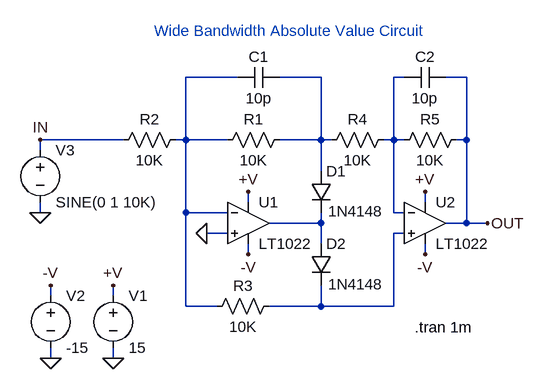
[diagram p0: schematic 1022.asc]
1022.asc, the LTspice schematic file:
Version 4
SHEET 1 896 680
WIRE 176 16 96 16
WIRE 304 16 240 16
WIRE 432 16 416 16
WIRE 528 16 496 16
WIRE 0 112 -128 112
WIRE 96 112 96 16
WIRE 96 112 80 112
WIRE 160 112 96 112
WIRE 304 112 304 16
WIRE 304 112 240 112
WIRE 320 112 304 112
WIRE 416 112 416 16
WIRE 416 112 400 112
WIRE 432 112 416 112
WIRE 528 112 528 16
WIRE 528 112 512 112
WIRE -128 128 -128 112
WIRE 304 160 304 112
WIRE 192 208 192 192
WIRE 464 208 464 192
WIRE -128 224 -128 208
WIRE 96 224 96 112
WIRE 160 224 96 224
WIRE 416 224 416 112
WIRE 432 224 416 224
WIRE 304 240 304 224
WIRE 304 240 224 240
WIRE 528 240 528 112
WIRE 528 240 496 240
WIRE 560 240 528 240
WIRE 160 256 128 256
WIRE 432 256 416 256
WIRE 304 272 304 240
WIRE 192 288 192 272
WIRE 464 288 464 272
WIRE -112 352 -112 336
WIRE -16 352 -16 336
WIRE 96 368 96 224
WIRE 144 368 96 368
WIRE 304 368 304 336
WIRE 304 368 224 368
WIRE 416 368 416 256
WIRE 416 368 304 368
WIRE -112 448 -112 432
WIRE -16 448 -16 432
FLAG -16 448 0
FLAG 192 192 +V
FLAG -16 336 +V
FLAG 192 288 -V
FLAG -112 448 0
FLAG -112 336 -V
FLAG -128 224 0
FLAG 464 192 +V
FLAG 464 288 -V
FLAG 128 256 0
FLAG -128 112 IN
FLAG 560 240 OUT
SYMBOL voltage -16 336 R0
SYMATTR InstName V1
SYMATTR Value 15
SYMBOL voltage -112 336 R0
SYMATTR InstName V2
SYMATTR Value -15
SYMBOL res 256 96 R90
WINDOW 0 0 56 VBottom 2
WINDOW 3 32 56 VTop 2
SYMATTR InstName R1
SYMATTR Value 10K
SYMBOL res 96 96 R90
WINDOW 0 0 56 VBottom 2
WINDOW 3 32 56 VTop 2
SYMATTR InstName R2
SYMATTR Value 10K
SYMBOL voltage -128 112 R0
SYMATTR InstName V3
SYMATTR Value SINE(0 1 10K)
SYMBOL opamps\\LT1022 192 176 R0
SYMATTR InstName U1
SYMBOL opamps\\LT1022 464 176 R0
SYMATTR InstName U2
SYMBOL diode 288 160 R0
WINDOW 3 27 62 Left 2
SYMATTR Value 1N4148
SYMATTR InstName D1
SYMBOL diode 288 272 R0
WINDOW 3 27 62 Left 2
SYMATTR Value 1N4148
SYMATTR InstName D2
SYMBOL res 240 352 R90
WINDOW 0 0 56 VBottom 2
WINDOW 3 32 56 VTop 2
SYMATTR InstName R3
SYMATTR Value 10K
SYMBOL cap 240 0 R90
WINDOW 0 0 32 VBottom 2
WINDOW 3 32 32 VTop 2
SYMATTR InstName C1
SYMATTR Value 10p
SYMBOL res 416 96 R90
WINDOW 0 0 56 VBottom 2
WINDOW 3 32 56 VTop 2
SYMATTR InstName R4
SYMATTR Value 10K
SYMBOL res 528 96 R90
WINDOW 0 0 56 VBottom 2
WINDOW 3 32 56 VTop 2
SYMATTR InstName R5
SYMATTR Value 10K
SYMBOL cap 496 0 R90
WINDOW 0 0 32 VBottom 2
WINDOW 3 32 32 VTop 2
SYMATTR InstName C2
SYMATTR Value 10p
TEXT 448 400 Left 2 !.tran 1m
TEXT 256 -40 Bottom 2 ;Wide Bandwidth Absolute Value Circuit

The netlist it stands for:
* 1022.asc
V1 +V 0 15
V2 -V 0 -15
R1 N002 N001 10K
R2 N001 IN 10K
V3 IN 0 SINE(0 1 10K)
XU1 0 N001 +V -V N004 LT1022  ; pins In+ In- V+ V- OUT
XU2 N005 N003 +V -V OUT LT1022  ; pins In+ In- V+ V- OUT
D1 N002 N004 1N4148
D2 N004 N005 1N4148
R3 N005 N001 10K
C1 N002 N001 10p
R4 N003 N002 10K
R5 OUT N003 10K
C2 OUT N003 10p
.model D D
.lib standard.dio
.tran 1m
* Wide Bandwidth Absolute Value Circuit
.backanno
.end